# EAGLE design untitled (EAGLE 9.6.1)
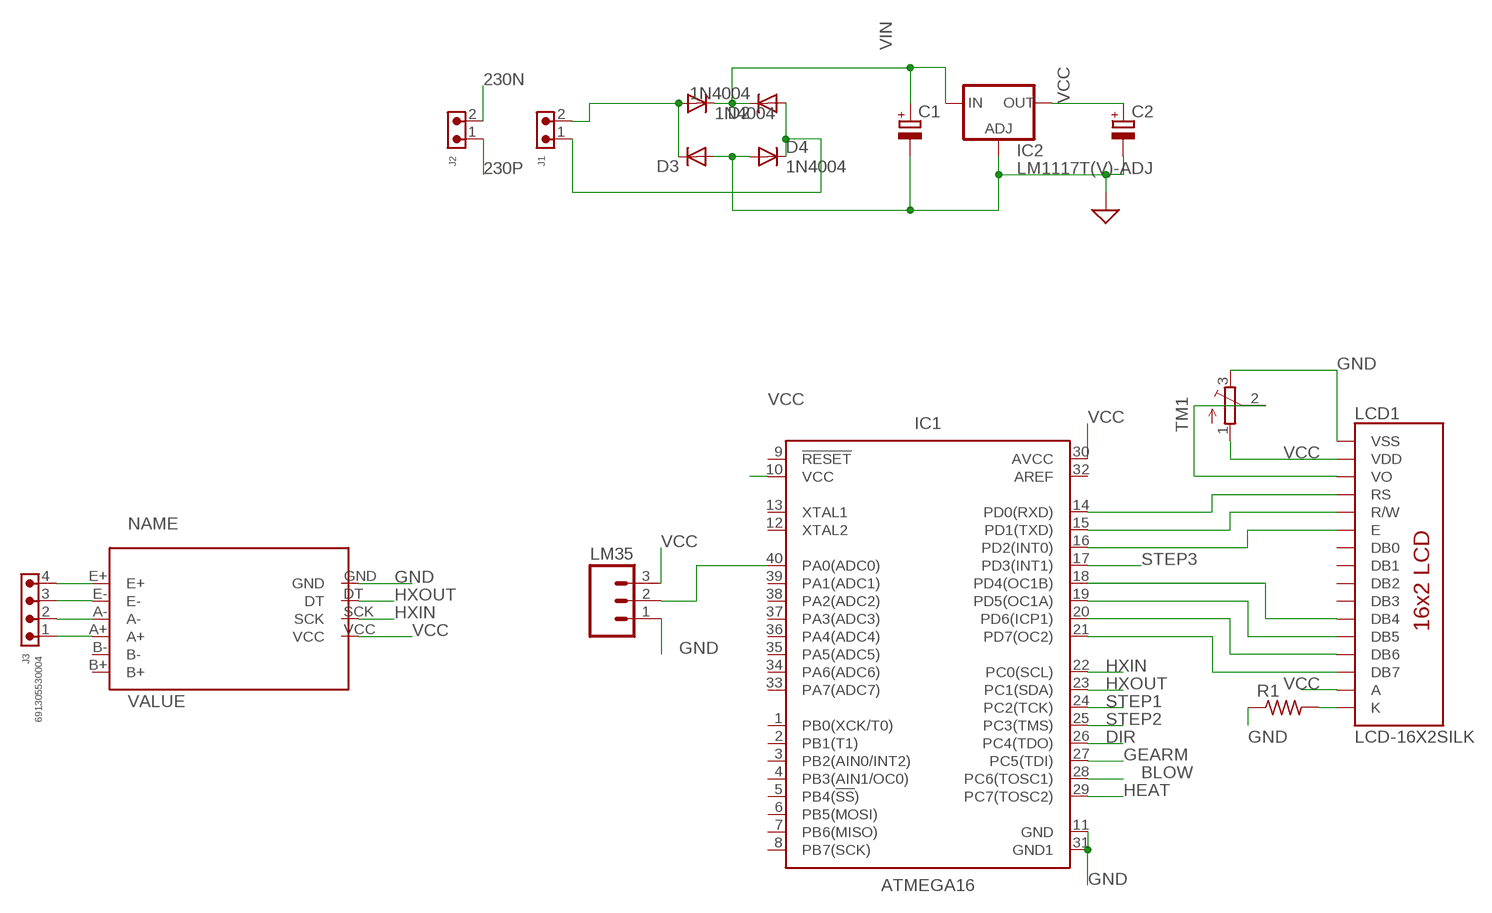
[diagram p0: schematic, sheet 1]

## Parts
C1  CPOL-EUE5-10.5  [E5-10,5]
C2  CPOL-EUE5-10.5  [E5-10,5]
D1  1N4004  [DO41-10]
D2  1N4004  [DO41-10]
D3  1N4004  [DO41-10]
D4  1N4004  [DO41-10]
IC1  ATMEGA16  ATMEGA32-16PU_DIP  [DIP1587W56P254L5229H482Q40B]
IC2  LM1117T(V)-ADJ  [TO220V]
J1  691305530002  [691305530002]
J2  691305530002  [691305530002]
J3  691305530004  691305530004  [691305530004]
LCD1  LCD-16X2SILK  [LCD-16X2]
LM35  M03  [03P]
R1  R-US_0207/9  [0207/9]
TM1  TRIMPOTTC33X  [TC33X]
U$3  HX711A  [HX711]

## Nets
230N: J2.2
230P: J2.1
BLOW: IC1.28(PC6(TOSC1))
DIR: IC1.26(PC4(TDO))
GEARM: IC1.27(PC5(TDI))
GND: C1.- C2.- D3.A D4.A IC1.11(GND) IC1.31(GND1) IC2.1(ADJ) LCD1.1(VSS) LM35.1 R1.1 TM1.3(E) U$3.GND ; supply symbol labelled SUP
HEAT: IC1.29(PC7(TOSC2))
HXIN: IC1.22(PC0(SCL)) U$3.SCK
HXOUT: IC1.23(PC1(SDA)) U$3.DT
N$1: D1.A D3.C J1.2
N$2: D2.A D4.C J1.1
N$3: J3.4 U$3.E+
N$9: J3.3 U$3.E-
N$10: J3.2 U$3.A-
N$11: J3.1 U$3.A+
N$15: IC1.21(PD7(OC2)) LCD1.14(DB7)
N$16: IC1.20(PD6(ICP1)) LCD1.13(DB6)
N$17: IC1.19(PD5(OC1A)) LCD1.12(DB5)
N$18: IC1.18(PD4(OC1B)) LCD1.11(DB4)
N$19: IC1.14(PD0(RXD)) LCD1.4(RS)
N$20: IC1.15(PD1(TXD)) LCD1.5(R/W)
N$21: IC1.16(PD2(INT0)) LCD1.6(E)
N$23: LCD1.3(VO) TM1.2(S)
N$25: LCD1.16(K) R1.2
N$39: IC1.40(PA0(ADC0)) LM35.2
STEP1: IC1.24(PC2(TCK))
STEP2: IC1.25(PC3(TMS))
STEP3: IC1.17(PD3(INT1))
VCC: C2.+ IC1.10(VCC) IC1.30(AVCC) IC2.2(OUT) LCD1.2(VDD) LCD1.15(A) LM35.3 TM1.1(A) U$3.VCC
VIN: C1.+ D1.C D2.C IC2.3(IN)
Unconnected: IC1.1(PB0(XCK/T0)) IC1.2(PB1(T1)) IC1.3(PB2(AIN0/INT2)) IC1.4(PB3(AIN1/OC0)) IC1.5(PB4(!SS!)) IC1.6(PB5(MOSI)) IC1.7(PB6(MISO)) IC1.8(PB7(SCK)) IC1.9(!RESET!) IC1.12(XTAL2) IC1.13(XTAL1) IC1.32(AREF) IC1.33(PA7(ADC7)) IC1.34(PA6(ADC6)) IC1.35(PA5(ADC5)) IC1.36(PA4(ADC4)) IC1.37(PA3(ADC3)) IC1.38(PA2(ADC2)) IC1.39(PA1(ADC1)) LCD1.7(DB0) LCD1.8(DB1) LCD1.9(DB2) LCD1.10(DB3) U$3.B+ U$3.B-

## Library data of the parts
C1 C2 = rcl:CPOL-EU: POLARIZED CAPACITOR, European symbol; SPICEPREFIX: C
D1-D4 = adafruit:1N4004: DIODE General purpose 1N400x type rectifier (With bigger pads) http://www.ladyada.net/library/pcb/eaglelibrary.html
IC1 = IC_Embedded:ATMEGA32*DIP: 8-bit Microcontroller with 32KBytes In-System Programmable Flash Datasheet <http://ww1.microchip.com/downloads/en/DeviceDoc/doc2503.pdf>; CATEGORY: IC_Embedded; DESCRIPTION: IC MCU 8BIT 32KB FLASH 40DIP; MANUFACTURER: Microchip Technology; MPN: ATMEGA32-16PU; OPERATING_TEMP: -40°C to 85°C; PART_STATUS: Active; SERIES: AVR® ATmega; SPEED: 16MHz; SUB-CATEGORY: Microcontroller
IC2 = lm1117_10:LM1117?-ADJ: 800mA Low-Dropout Linear Regulator Source: http://www.ti.com/lit/ds/symlink/lm1117-n.pdf; MF: Texas Instruments; MPN: LM1777T-ADJ; OC_FARNELL: 9485805; OC_NEWARK: 13B5345
J1 J2 = Wurth_Connectors_WR-TBL Pluggable Connector:691305530002: WR-TBL Serie 3055 - 5,08 mm - PCB Header Vertical Entry with Plastic Latches KIND PROPERTIES Pitch 5.08 mm MATERIAL PROPERTIES Insulator Material PA66 Insulator Flammability Rating UL94 V-0 Insulator Color Green Terminal Material Copper Alloy Terminal Plating Tin-plated surface GENERAL INFORMATION Operating Temperature -40 up to +105 °C ELECTRICAL PROPERTIES IR UL 16 A Working Voltage [UL] 300 V (AC) Withstanding Voltage [UL] 2500 V (AC) Contact Resistance [UL] 20 mΩ CERTIFICATION UL Approval E315414 <https://www.we-online.com/catalog/media/o135349v209%20Family_WR-TBL3_6913055300xx.jpg> Details see: https://www.we-online.com/catalog/en/TBL_5_08_3055_6913055300XX/ Updated by Ella Wu 2019-12-30 2019(C) Wurth Elektronik; DATASHEET-URL: https://www.we-online.com/catalog/datasheet/691305530002.pdf; IR-UL: 16A; MOUNT: THT; PART-NUMBER: 691305530002; PINS: 2; PITCH: 5.08mm; TYPE: Vertical; WORKING-VOLTAGE-UL: 300V (AC)
J3 = Wurth_Connectors_WR-TBL Pluggable Connector:691305530004: WR-TBL Serie 3055 - 5,08 mm - PCB Header Vertical Entry with Plastic Latches KIND PROPERTIES Pitch 5.08 mm MATERIAL PROPERTIES Insulator Material PA66 Insulator Flammability Rating UL94 V-0 Insulator Color Green Terminal Material Copper Alloy Terminal Plating Tin-plated surface GENERAL INFORMATION Operating Temperature -40 up to +105 °C ELECTRICAL PROPERTIES IR UL 16 A Working Voltage [UL] 300 V (AC) Withstanding Voltage [UL] 2500 V (AC) Contact Resistance [UL] 20 mΩ CERTIFICATION UL Approval E315414 <https://www.we-online.com/catalog/media/o135349v209%20Family_WR-TBL3_6913055300xx.jpg> Details see: https://www.we-online.com/catalog/en/TBL_5_08_3055_6913055300XX/ Updated by Ella Wu 2019-12-30 2019(C) Wurth Elektronik; DATASHEET-URL: https://www.we-online.com/catalog/datasheet/691305530004.pdf; IR-UL: 16A; MOUNT: THT; PART-NUMBER: 691305530004; PINS: 4; PITCH: 5.08mm; TYPE: Vertical; WORKING-VOLTAGE-UL: 300V (AC)
LCD1 = SparkFun-Displays:LCD-16X2: Standard text-only 16x2 parallel input LCD Basic 16 character by 2 line display. Typically utilizes the extremely common HD44780 parallel interface chipset SparkFun Products: Basic 16x2 Green <https://www.sparkfun.com/products/255> Basic 8x2 Green <https://www.sparkfun.com/products/11122>; SF_ID: LCD-00255
LM35 = con-amp-quick:M03: AMP QUICK CONNECTOR; OC_FARNELL: unknown; OC_NEWARK: unknown
R1 = adafruit:R-US_: RESISTOR, American symbol
TM1 = adafruit:TRIMPOT: SMT trimmer potentiometer part number TC33X http://www.ladyada.net/library/eagle
U$3 = HX711:HX711

## Board
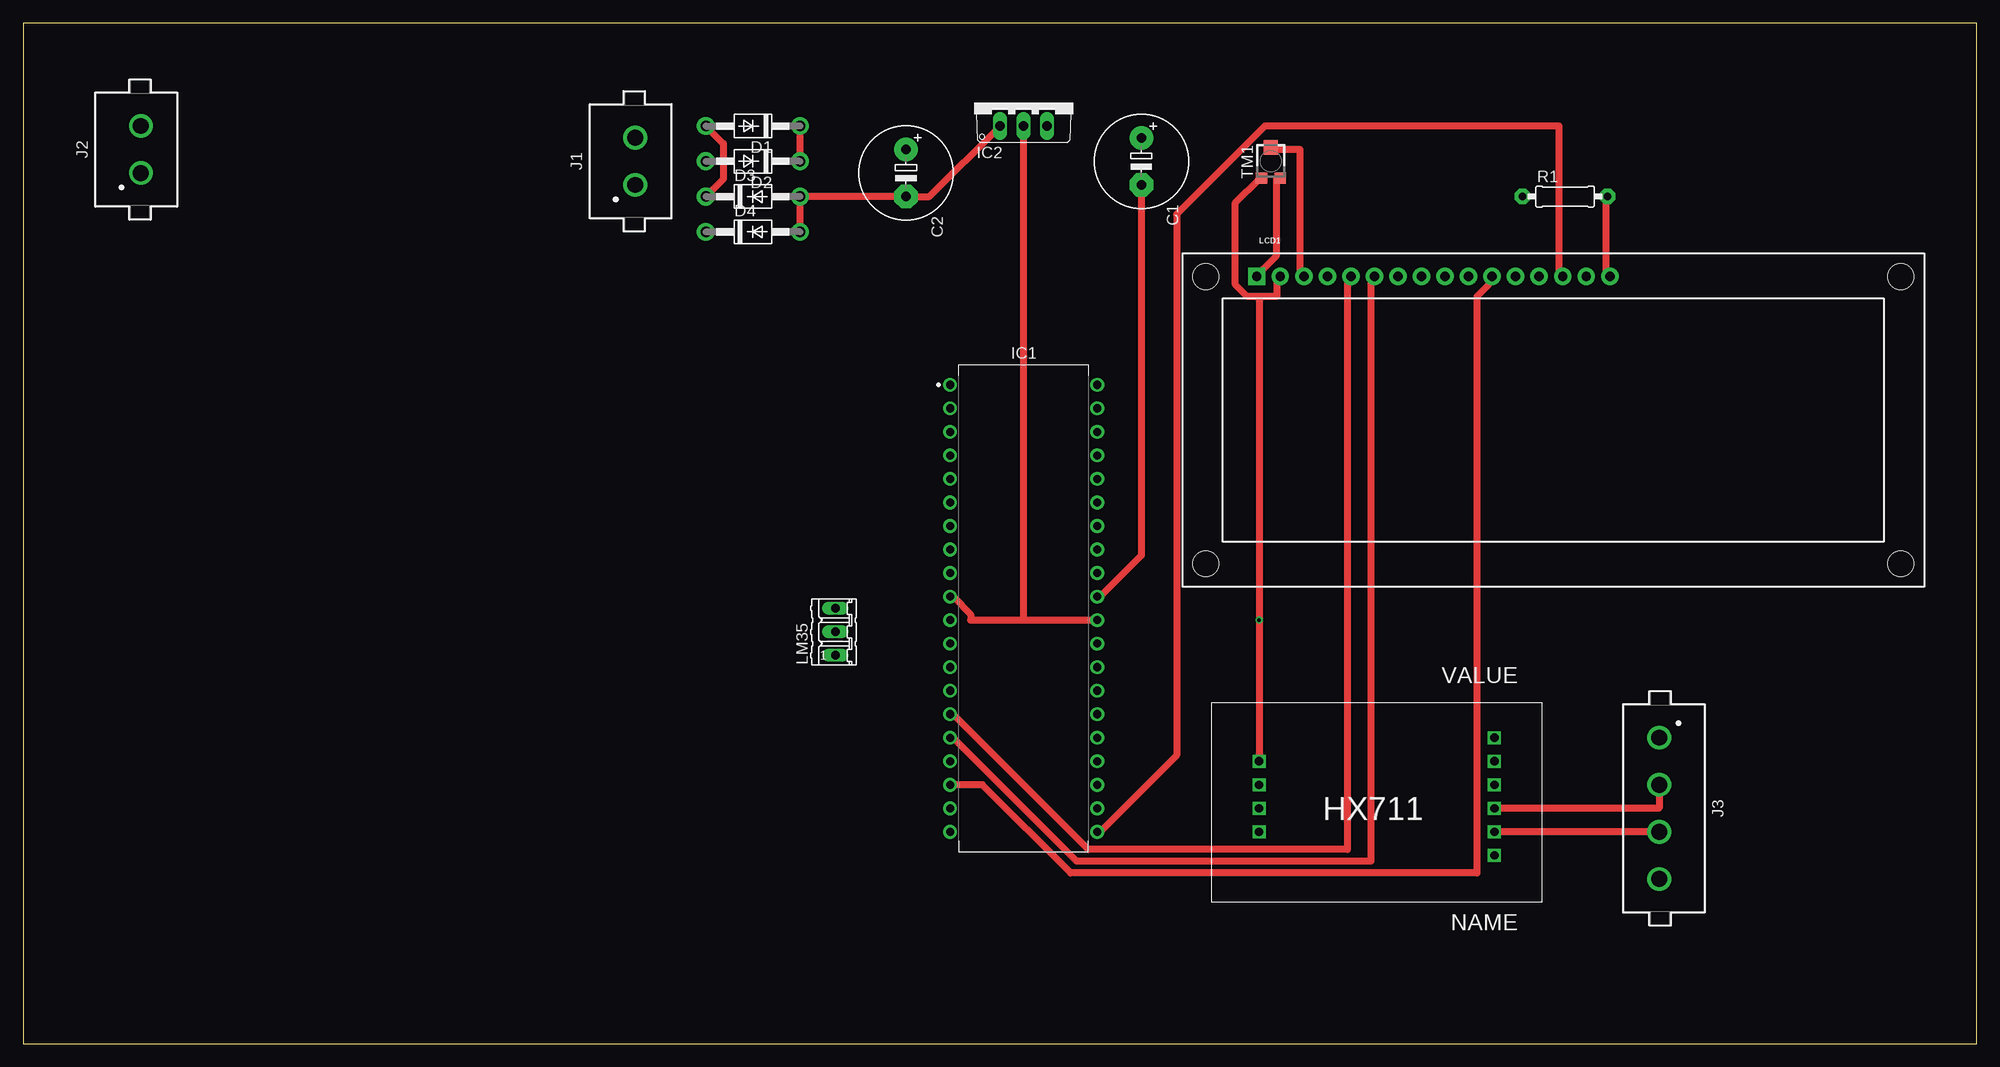
[diagram p1: board, top side]
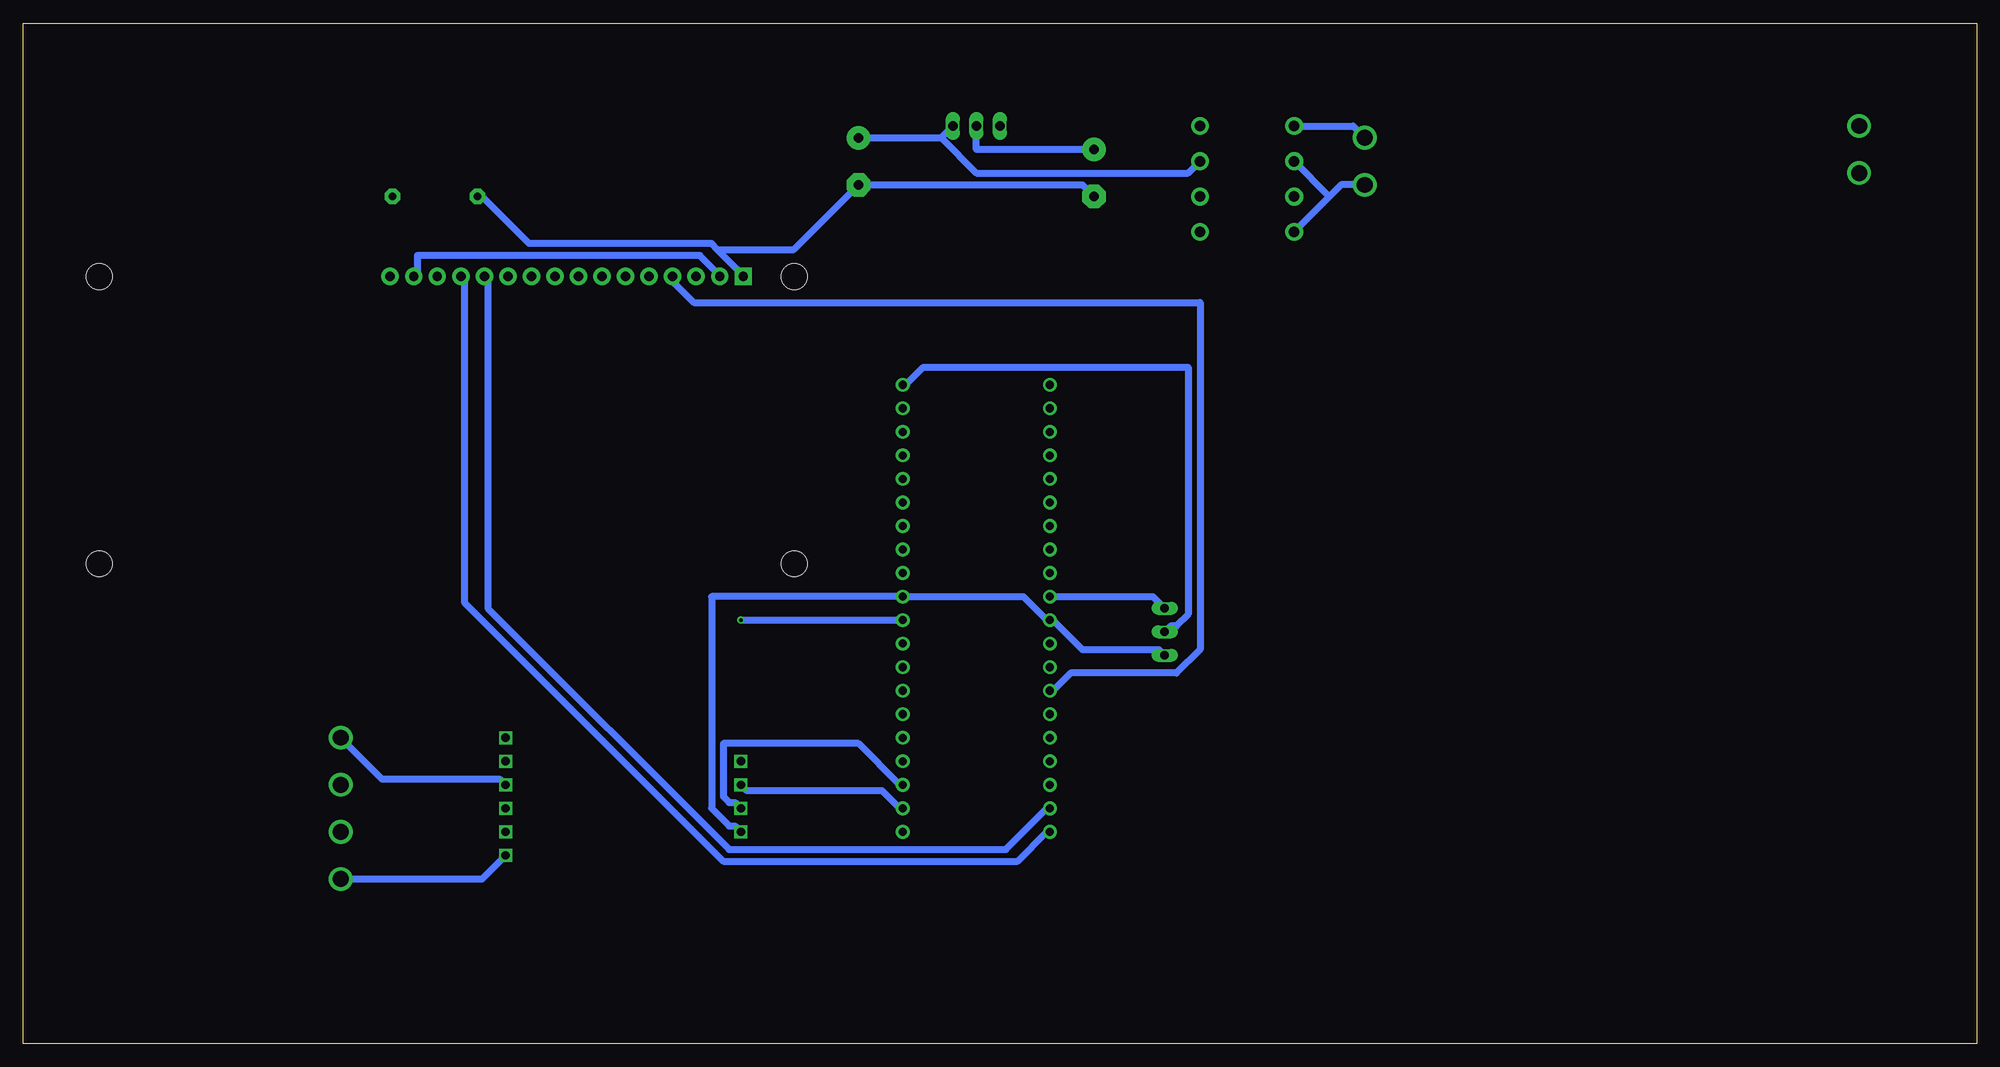
[diagram p2: board, bottom side, seen from below]

Size 210.8 x 110.16 mm. Coordinates in mm from the lower left corner, seen from the top.
Outline: 0,0 210.8,0 210.8,110.16 0,110.16 0,0
Copper layers (1*16): Top 0.035mm / dielectric 1.5mm / Bottom 0.035mm
Design rules "default *": minimum track width 30mil, minimum drill 0.35mm, track to track 20mil, track to pad 20mil, pad to pad 6mil, via to via 6mil, smd to smd 6mil, copper to edge 40mil, drill to drill 6mil, minimum pad ring 10mil, minimum via ring 8mil, stop-mask expansion 4mil, vias tented up to drill 0mil, thermal gap 10mil

### Footprints (pad centres in the part's own frame; a part is rotated, then mirrored left to right if it is on the bottom)
E5-10,5 = drill 1.016 pad 2.54: + -2.54,0 | drill 1.016 pad 2.54 octagon: - 2.54,0
DO41-10 = drill 1.118 pad 1.93: A 5.08,0; C -5.08,0
DIP1587W56P254L5229H482Q40B = drill 0.877 pad 1.477: 1 -7.938,24.13; 2 -7.938,21.59; 3 -7.938,19.05; 4 -7.938,16.51; 5 -7.938,13.97; 6 -7.938,11.43; 7 -7.938,8.89; 8 -7.938,6.35; 9 -7.938,3.81; 10 -7.938,1.27; 11 -7.938,-1.27; 12 -7.938,-3.81; 13 -7.938,-6.35; 14 -7.938,-8.89; 15 -7.938,-11.43; 16 -7.938,-13.97; 17 -7.938,-16.51; 18 -7.938,-19.05; 19 -7.938,-21.59; 20 -7.938,-24.13; 21 7.938,-24.13; 22 7.938,-21.59; 23 7.938,-19.05; 24 7.938,-16.51; 25 7.938,-13.97; 26 7.938,-11.43; 27 7.938,-8.89; 28 7.938,-6.35; 29 7.938,-3.81; 30 7.938,-1.27; 31 7.938,1.27; 32 7.938,3.81; 33 7.938,6.35; 34 7.938,8.89; 35 7.938,11.43; 36 7.938,13.97; 37 7.938,16.51; 38 7.938,19.05; 39 7.938,21.59; 40 7.938,24.13
TO220V = drill 1.016 long: 1 -2.54,-2.54; 2 0,-2.54; 3 2.54,-2.54
691305530002 = drill 1.7: 1 -2.54,0; 2 2.54,0
691305530004 = drill 1.7: 1 -7.62,0; 2 -2.54,0; 3 2.54,0; 4 7.62,0
LCD-16X2 = drill 1.016 pad 1.88 square: 1 -32,15.5 | drill 1.016 pad 1.88: 2 -29.46,15.5; 3 -26.92,15.5; 4 -24.38,15.5; 5 -21.84,15.5; 6 -19.3,15.5; 7 -16.76,15.5; 8 -14.22,15.5; 9 -11.68,15.5; 10 -9.14,15.5; 11 -6.6,15.5; 12 -4.06,15.5; 13 -1.52,15.5; 14 1.02,15.5; 15 3.56,15.5; 16 6.1,15.5 | hole 2.8: -37.5,15.5; -37.5,-15.5; 37.5,15.5; 37.5,-15.5
03P = drill 0.914 long: 1 -2.54,0; 2 0,0; 3 2.54,0
0207/9 = drill 0.813 pad 1.676 octagon: 1 -4.572,0; 2 4.572,0
TC33X = smd 1.2 x 1.2: 1 -1,-1.825; 3 1,-1.825 | smd 1.5 x 1.6: 2 0,1.5
HX711 = drill 0.9 square: A+ 8.89,21.59; A- 8.89,24.13; B+ 8.89,16.51; B- 8.89,19.05; DT 34.29,24.13; E+ 8.89,29.21; E- 8.89,26.67; GND 34.29,26.67; SCK 34.29,21.59; VCC 34.29,19.05

### Placement (x,y rotation side)
C1  120.65,95.25 270 top
C2  95.25,93.98 270 top
D1  78.74,99.06 180 top
D2  78.74,95.25 180 top
D3  78.74,91.44 0 top
D4  78.74,87.63 0 top
IC1  107.95,46.99 0 top
IC2  107.95,101.6 0 top
J1  66.04,95.25 90 top
J2  12.7,96.52 90 top
J3  176.53,25.4 270 top
LCD1  165.1,67.31 0 top
LM35  87.63,44.45 90 top
R1  166.37,91.44 0 top
TM1  134.62,95.25 0 top
U$3  167.64,49.53 180 top

### Tracks (layer width: path | path; a pad name or v marks a point on that pad's centre or on a via)
GND
  Top 0.762: D4.A D3.A C2.- 97.79,91.44 IC2.1 | TM1.3 135.25,93.34 135.25,85.09 133.35,83.19 LCD1.1 | C1.- 120.65,52.71 116.21,48.26 IC1.31
  Bottom 0.762: LM35.1 88.26,42.54 96.52,42.54 99.69,45.72 IC1.11 100.33,45.72 102.87,48.26 IC1.31 136.53,48.26 136.53,25.4 134.62,23.5 133.99,23.5 U$3.GND | 135.89,85.72 133.35,83.19 LCD1.1 | 135.89,85.72 136.53,86.36 156.21,86.36 161.29,91.44 R1.1 | 135.89,85.72 127.63,85.72 C1.- 96.52,92.71 C2.-
HXIN
  Bottom 0.762: U$3.SCK 132.72,27.3 118.11,27.3 116.21,25.4 IC1.22
HXOUT
  Bottom 0.762: U$3.DT 133.99,26.04 134.62,26.04 135.25,26.67 135.25,32.38 120.65,32.38 116.21,27.94 IC1.23
N$1
  Top 0.762: D3.C 75.56,93.34 75.56,97.16 D1.A
  Bottom 0.762: J1.2 67.31,99.06 D1.A
N$2
  Bottom 0.762: 69.85,91.44 68.58,92.71 J1.1 | 69.85,91.44 D4.C | 69.85,91.44 D2.A
N$3
  Bottom 0.762: U$3.E+ 161.29,17.78 J3.4
N$9
  Top 0.762: J3.3 U$3.E-
N$10
  Top 0.762: U$3.A- 176.53,25.4 J3.2
N$11
  Bottom 0.762: U$3.A+ 159.39,28.58 172.09,28.58 J3.1
N$15
  Top 0.762: IC1.21 116.21,22.86 124.46,31.12 124.46,89.53 133.99,99.06 165.74,99.06 165.74,83.19 LCD1.14
N$16
  Bottom 0.762: IC1.20 100.33,22.86 103.5,19.69 135.25,19.69 163.19,47.63 163.19,82.55 LCD1.13
N$17
  Bottom 0.762: IC1.19 100.33,25.4 104.78,20.95 134.62,20.95 160.66,46.99 160.66,82.55 LCD1.12
N$18
  Top 0.762: IC1.18 103.5,27.94 113.03,18.41 156.84,18.41 156.84,80.65 158.12,81.91 158.12,82.55 LCD1.11
N$19
  Bottom 0.762: IC1.14 99.69,38.1 97.79,40.01 86.36,40.01 83.82,42.54 83.82,80.01 138.43,80.01 140.97,82.55 LCD1.4
N$20
  Top 0.762: IC1.15 100.33,35.56 114.94,20.95 142.88,20.95 142.88,82.55 LCD1.5
N$21
  Top 0.762: IC1.16 100.33,33.02 113.66,19.69 145.42,19.69 145.42,82.55 LCD1.6
N$23
  Top 0.762: TM1.2 134.62,96.52 137.79,96.52 137.79,83.19 LCD1.3
N$25
  Top 0.762: R1.2 170.81,91.44 170.81,83.19 LCD1.16
N$39
  Bottom 0.762: LM35.2 87,45.09 86.36,45.09 85.09,46.35 85.09,73.03 113.66,73.03 115.57,71.12 IC1.40
VCC  (via drill 0.35)
  Top 0.762: 107.95,45.72 102.24,45.72 102.24,46.35 100.33,48.26 IC1.10 | 107.95,45.72 IC1.30 | 107.95,45.72 IC2.2 | 133.35,80.65 135.25,80.65 135.25,82.55 LCD1.2 | 133.35,80.65 132.08,80.65 130.81,81.91 130.81,90.81 133.35,93.34 TM1.1 | 133.35,80.65 v133.35,45.72 U$3.VCC
  Bottom 0.762: IC2.2 107.95,96.52 C2.+ | LM35.3 88.9,48.26 IC1.10 | LCD1.15 168.28,83.19 168.28,85.09 137.79,85.09 135.89,83.19 LCD1.2 | v133.35,45.72 IC1.30
VIN
  Top 0.762: D1.C D2.C
  Bottom 0.762: 111.76,97.79 IC2.3 | C1.+ 111.76,97.79 | D2.C 85.09,93.98 107.95,93.98 111.76,97.79